# EAGLE design neojoint1a-090 (EAGLE 6.6.0)
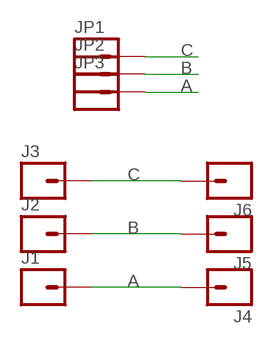
[diagram p0: schematic, sheet 1]

## Parts
J1  M01SMD-4.5X1.5  [PAD-1.5X4.5]
J2  M01SMD-4.5X1.5  [PAD-1.5X4.5]
J3  M01SMD-4.5X1.5  [PAD-1.5X4.5]
J4  M01SMD-4.5X1.5  [PAD-1.5X4.5]
J5  M01SMD-4.5X1.5  [PAD-1.5X4.5]
J6  M01SMD-4.5X1.5  [PAD-1.5X4.5]
JP1  M01PTH  [1X01]
JP2  M01PTH  [1X01]
JP3  M01PTH  [1X01]

## Nets
A: J1.P$1 J4.P$1 JP3.1
B: J2.P$1 J5.P$1 JP2.1
C: J3.P$1 J6.P$1 JP1.1

## Library data of the parts
J1-J6 JP1-JP3 = SparkFun-Connectors:M01: Header 1 Standard 1-pin 0.1" header. Use with straight break away headers (SKU : PRT-00116), right angle break away headers (PRT-00553), swiss pins (PRT-00743), machine pins (PRT-00117), and female headers (PRT-00115).

## Board
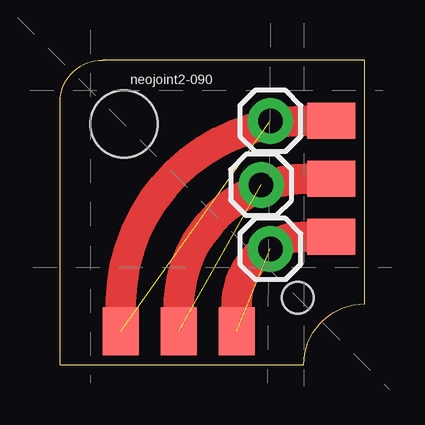
[diagram p1: board, top side]

Size 12.7 x 12.7 mm. Coordinates in mm from the lower left corner, seen from the top.
Outline: 0,0 10.16,0 arc-90 12.7,2.54 12.7,12.7 1.78,12.7 arc90 0,10.92 0,10.79 0,0
Copper layers (1*16): Top 0.0356mm / dielectric 1.5011mm / Bottom 0.0356mm
Design rules "LaenPCBOrder-tod": minimum track width 10mil, minimum drill 13mil, track to track 6mil, track to pad 8mil, pad to pad 8mil, via to via 8mil, smd to smd 6mil, copper to edge 15mil, drill to drill 8mil, minimum pad ring 7mil, minimum via ring 7mil, stop-mask expansion 4mil, vias tented up to drill 25mil, thermal gap 10mil
Holes 2.8 mm at 2.67,10.03
Holes 1.3 mm at 9.91,2.79

### Footprints (pad centres in the part's own frame; a part is rotated, then mirrored left to right if it is on the bottom)
PAD-1.5X4.5 = smd 1.5 x 2: P$1 0,0
1X01 = drill 1.016 pad 1.88: 1 0,0

### Placement (x,y rotation side)
J1  7.37,1.4 0 top
J2  4.95,1.4 0 top
J3  11.3,10.16 270 top
J4  11.3,5.33 270 top
J5  11.3,7.75 270 top
J6  2.54,1.4 0 top
JP1  8.76,10.16 0 top
JP2  8.38,7.49 0 top
JP3  8.76,4.83 0 top

### Tracks (layer width: path | path; a pad name or v marks a point on that pad's centre or on a via)
A  (1 unrouted)
  Top 1.27: J4.P$1 10.16,5.33 arc87 7.37,2.67 arc5 J1.P$1
B  (1 unrouted)
  Top 1.27: J5.P$1 10.29,7.75 arc87 4.95,2.67 arc6 J2.P$1
C  (1 unrouted)
  Top 1.27: 2.41,1.52 J6.P$1 arc-2 2.54,2.67 arc-89 10.16,10.16 J3.P$1

### Text on the board
tPlace: neojoint2-090